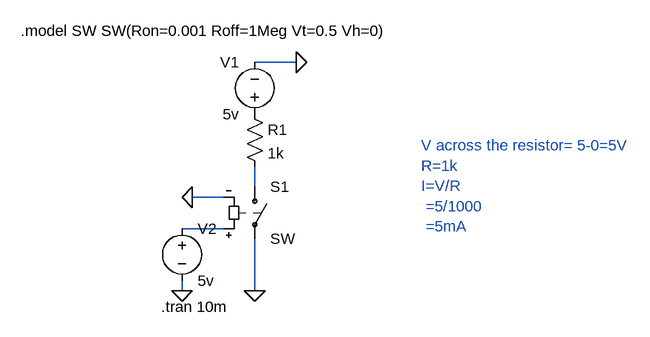
[diagram p0: schematic SW B(parallel).asc]
SW B(parallel).asc, the LTspice schematic file:
Version 4.1
SHEET 1 880 680
WIRE 128 64 64 64
WIRE 64 256 64 224
WIRE 16 272 -32 272
WIRE 16 320 -48 320
WIRE -48 416 -48 400
WIRE 64 416 64 336
FLAG -48 416 0
FLAG -32 272 0
FLAG 64 416 0
FLAG 128 64 0
SYMBOL voltage 64 160 R180
WINDOW 0 24 96 Left 2
WINDOW 3 24 16 Left 2
SYMATTR InstName V1
SYMATTR Value 5v
SYMBOL res 48 128 R0
SYMATTR InstName R1
SYMATTR Value 1k
SYMBOL sw 64 240 R0
SYMATTR InstName S1
SYMBOL voltage -48 304 R0
SYMATTR InstName V2
SYMATTR Value 5v
TEXT -80 440 Left 2 !.tran 10m
TEXT -296 16 Left 2 !.model SW SW(Ron=0.001 Roff=1Meg Vt=0.5 Vh=0)
TEXT 320 192 Left 2 ;V across the resistor= 5-0=5V\nR=1k\nI=V/R\n =5/1000\n =5mA

The netlist it stands for:
* SW B(parallel).asc
V1 P001 0 5v
R1 P001 N001 1k
S1 N001 0 N002 0 SW
V2 N002 0 5v
.tran 10m
.model SW SW(Ron=0.001 Roff=1Meg Vt=0.5 Vh=0)
* V across the resistor= 5-0=5V
* R=1k
* I=V/R
*  =5/1000
*  =5mA
.backanno
.end